# EAGLE schematic PCB_Sch_v4 (EAGLE 9.3.0)

## Sheet 1 of 2
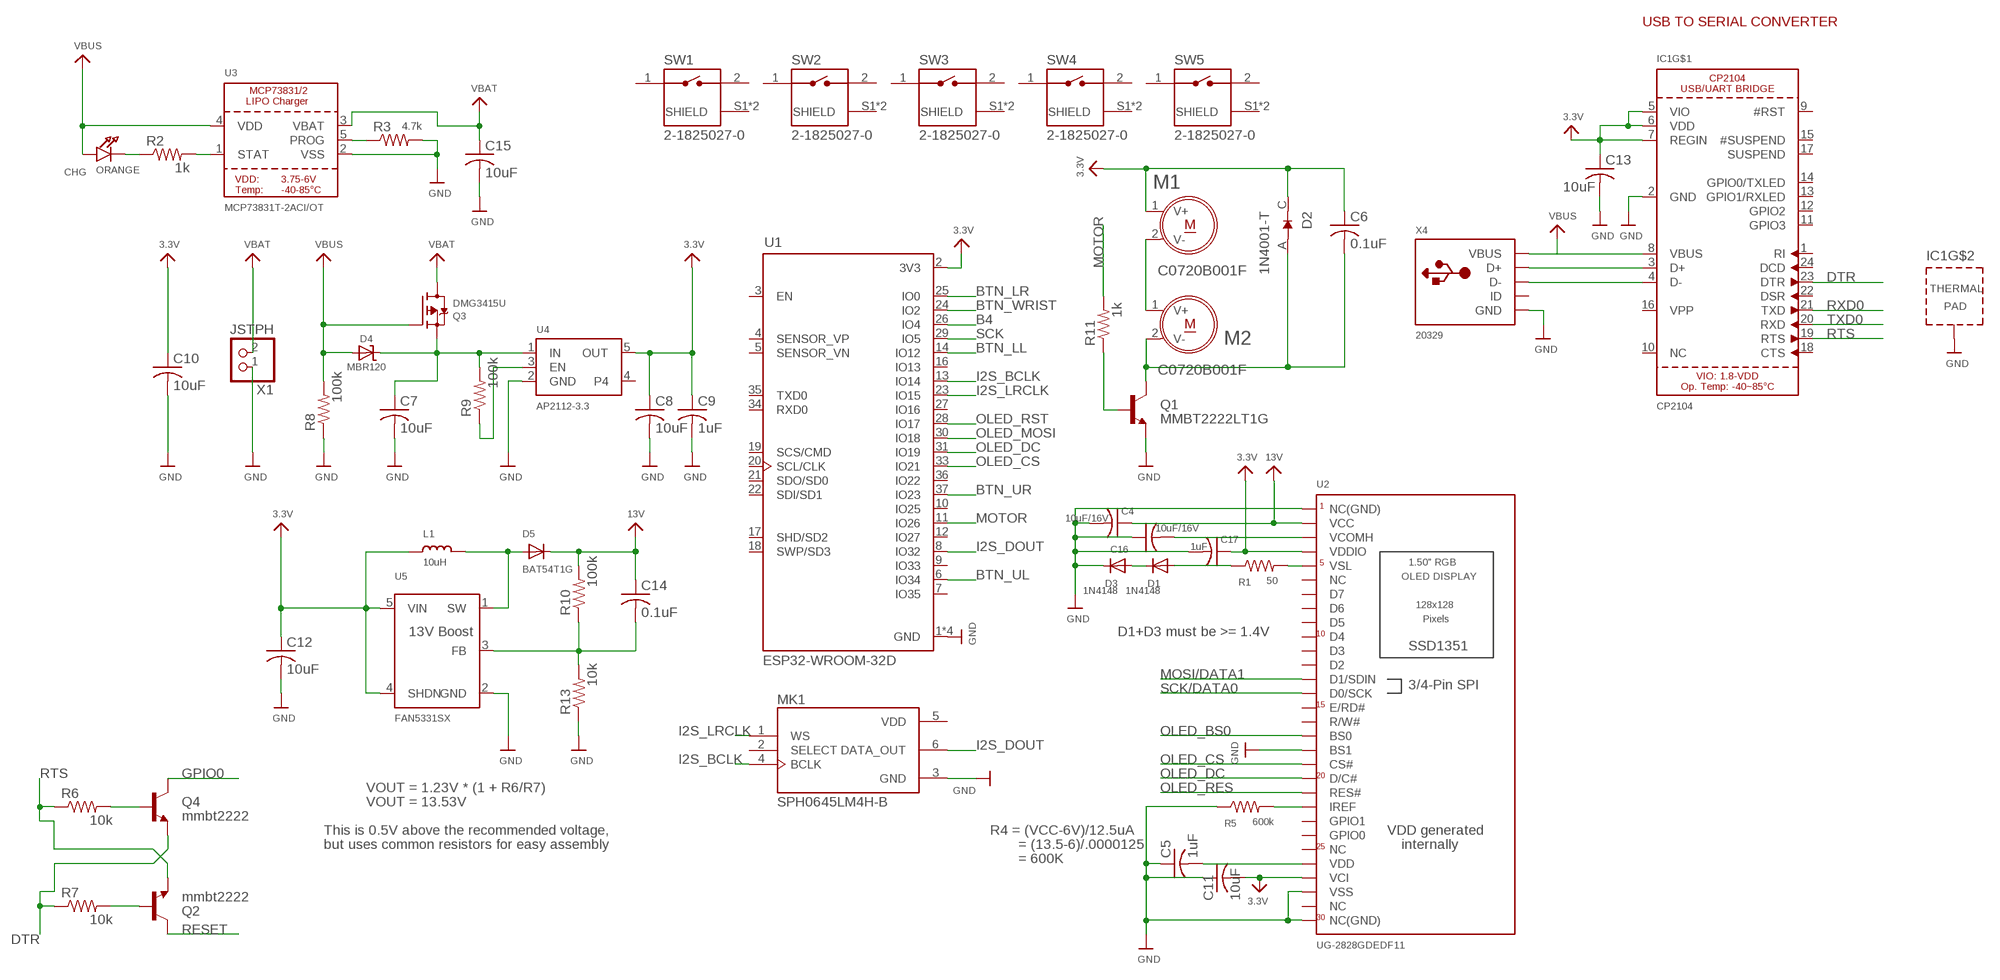
[diagram p0: schematic, sheet 1]

### Parts
C4  10uF/16V  C-USC0603  [C0603]
C5  1uF  C-USC0603  [C0603]
C6  0.1uF  C-USC0603  [C0603]
C7  10uF  C-USC0603  [C0603]
C8  10uF  C-USC0603  [C0603]
C9  1uF  C-USC0603  [C0603]
C10  10uF  C-USC0603  [C0603]
C11  10uF  C-USC0603  [C0603]
C12  10uF  C-USC0603  [C0603]
C13  10uF  C-USC0603  [C0603]
C14  0.1uF  C-USC0603  [C0603]
C15  10uF  C-USC0603  [C0603]
C16  10uF/16V  C-USC0603  [C0603]
C17  1uF  C-USC0603  [C0603]
CHG  ORANGE  LED0805_NOOUTLINE  [CHIPLED_0805_NOOUTLINE]
D1  1N4148  DIODESOD-323  [SOD-323]
D2  1N4001-T  [DIOAD953W69L521D272]
D3  1N4148  DIODESOD-323  [SOD-323]
D4  MBR120  DIODE-SCHOTTKYSOD-123  [SOD-123]
D5  BAT54T1G  DIODESOD-123  [SOD-123]
IC1  CP2104  [QFN24_4MM_SMSC]
L1  10uH  INDUCTOR  [INDUCTOR_1007]
M1  C0720B001F  [XDCR_C0720B001F]
M2  C0720B001F  [XDCR_C0720B001F]
MK1  SPH0645LM4H-B  [MIC_SPH0645LM4H-B]
Q1  MMBT2222LT1G  [SOT95P237X111-3N]
Q2  mmbt2222  TRANSISTOR_NPNSOT23-3  [SOT23-3]
Q3  DMG3415U  MOSFET-P  [SOT23-R]
Q4  mmbt2222  TRANSISTOR_NPNSOT23-3  [SOT23-3]
R1  50  R-US_R0603  [R0603]
R2  1k  R-US_R0603  [R0603]
R3  4.7k  R-US_R0603  [R0603]
R5  600k  R-US_R0603  [R0603]
R6  10k  R-US_R0603  [R0603]
R7  10k  R-US_R0603  [R0603]
R8  100k  R-US_R0603  [R0603]
R9  100k  R-US_R0603  [R0603]
R10  100k  R-US_R0603  [R0603]
R11  1k  R-US_R0603  [R0603]
R13  10k  R-US_R0603  [R0603]
SW1  2-1825027-0  [TE_2-1825027-0]
SW2  2-1825027-0  [TE_2-1825027-0]
SW3  2-1825027-0  [TE_2-1825027-0]
SW4  2-1825027-0  [TE_2-1825027-0]
SW5  2-1825027-0  [TE_2-1825027-0]
U1  ESP32-WROOM-32D  [MODULE_ESP32-WROOM-32D]
U2  UG-2828GDEDF11  DISP_OLED_UG-2828GDEDF11TOP  [FPC_XF2M-3015-1A]
U3  MCP73831T-2ACI/OT  MCP73831/2  [SOT23-5]
U4  AP2112-3.3  VREG_SOT23-5  [SOT23-5]
U5  FAN5331SX  FAN5331  [SOT23-5@1]
X1  JSTPH  CON_JST_PH_2PIN  [JSTPH2]
X4  20329  USB_MICRO_20329_V2  [4UCONN_20329_V2]

### Nets
3.3V: C6.1 C10.1 C11.2 C12.1 C13.1 C17.1 D2.C IC1.5(VIO) IC1.6(VDD) IC1.7(REGIN) L1.P$1 M1.1(V+) U1.2(3V3) U2.P$4(VCI) U2.P$27(VDDIO) U5.4(SHDN) U5.5(VIN)
13V: C4.1 C14.1 D5.C R10.2 U2.P$29(VCC)
B4: U1.26(IO4)
BTN_LL: U1.14(IO12)
BTN_LR: U1.25(IO0)
BTN_UL: U1.6(IO34)
BTN_UR: U1.37(IO23)
BTN_WRIST: U1.24(IO2)
DTR: IC1.23(DTR) Q4.2(E) R7.1
GND: C4.2 C5.1 C7.2 C8.2 C9.2 C10.2 C11.1 C12.2 C13.2 C15.2 C16.1 C17.2 D3.C IC1.2(GND) IC1.THERM(TP) MK1.3(GND) Q1.2(E) R3.2 R5.1 R8.1 R13.1 U1.1(GND) U1.15(GND) U1.38(GND) U1.39(GND) U2.P$1(NC(GND)) U2.P$3(VSS) U2.P$13(BS1) U2.P$30(NC(GND)) U3.2(VSS) U4.2(GND) U5.2(GND) X1.1 X4.BASE@1(GND) X4.BASE@2(GND) X4.GND X4.SPRT@1(GND) X4.SPRT@2(GND) X4.SPRT@3(GND) X4.SPRT@4(GND)
GPIO0: Q4.3(C)
I2S_BCLK: MK1.4(BCLK) U1.13(IO14)
I2S_DOUT: MK1.6(DATA_OUT) U1.8(IO32)
I2S_LRCLK: MK1.1(WS) U1.23(IO15)
MOSI/DATA1: U2.P$18(D1/SDIN)
MOTOR: R11.2 U1.11(IO26)
N$1: IC1.3(D+) X4.D+
N$2: Q1.1(B) R11.1
N$3: C5.2 U2.P$5(VDD)
N$4: C6.2 D2.A M2.2(V-) Q1.3(C)
N$5: IC1.4(D-) X4.D-
N$6: D1.A R1.1
N$7: R1.2 U2.P$26(VSL)
N$8: Q2.1(B) R7.2
N$9: Q4.1(B) R6.2
N$10: CHG.C R2.1
N$11: D1.C D3.A
N$12: C7.1 D4.C Q3.2(S) R9.2 U4.1(IN)
N$13: D5.A L1.P$2 U5.1(SW)
N$14: R9.1 U4.3(EN)
N$15: R2.2 U3.1(STAT)
N$16: C14.2 R10.1 R13.2 U5.3(FB)
N$17: R3.1 U3.5(PROG)
N$18: C16.2 U2.P$28(VCOMH)
N$19: R5.2 U2.P$9(IREF)
N$20: M1.2(V-) M2.1(V+)
OLED_BS0: U2.P$14(BS0)
OLED_CS: U1.33(IO21) U2.P$12(CS#)
OLED_DC: U1.31(IO19) U2.P$11(D/C#)
OLED_MOSI: U1.30(IO18)
OLED_RES: U2.P$10(RES#)
OLED_RST: U1.28(IO17)
OUT: C8.1 C9.1 U4.5(OUT) ; supply symbol labelled 3.3V
RESET: Q2.3(C)
RTS: IC1.19(RTS) Q2.2(E) R6.1
RXD0: IC1.21(TXD)
SCK: U1.29(IO5)
SCK/DATA0: U2.P$17(D0/SCK)
TXD0: IC1.20(RXD)
VBAT: C15.1 Q3.3(D) U3.3(VBAT) X1.2
VBUS: CHG.A D4.A Q3.1(G) R8.2 U3.4(VDD)
VBUS1: IC1.8(VBUS) X4.VBUS ; supply symbol labelled VBUS
Unconnected: IC1.1(RI) IC1.9(#RST) IC1.10(NC) IC1.11(GPIO3) IC1.12(GPIO2) IC1.13(GPIO1/RXLED) IC1.14(GPIO0/TXLED) IC1.15(#SUSPEND) IC1.16(VPP) IC1.17(SUSPEND) IC1.18(CTS) IC1.22(DSR) IC1.24(DCD) MK1.2(SELECT) SW1.1 SW1.2 SW1.S1(SHIELD) SW1.S2(SHIELD) SW2.1 SW2.2 SW2.S1(SHIELD) SW2.S2(SHIELD) SW3.1 SW3.2 SW3.S1(SHIELD) SW3.S2(SHIELD) SW4.1 SW4.2 SW4.S1(SHIELD) SW4.S2(SHIELD) SW5.1 SW5.2 SW5.S1(SHIELD) SW5.S2(SHIELD) U1.3(EN) U1.4(SENSOR_VP) U1.5(SENSOR_VN) U1.7(IO35) U1.9(IO33) U1.10(IO25) U1.12(IO27) U1.16(IO13) U1.17(SHD/SD2) U1.18(SWP/SD3) U1.19(SCS/CMD) U1.20(SCL/CLK) U1.21(SDO/SD0) U1.22(SDI/SD1) U1.27(IO16) U1.34(RXD0) U1.35(TXD0) U1.36(IO22) U2.P$2(NC) U2.P$6(NC) U2.P$7(GPIO0) U2.P$8(GPIO1) U2.P$15(R/W#) U2.P$16(E/RD#) U2.P$19(D2) U2.P$20(D3) U2.P$21(D4) U2.P$22(D5) U2.P$23(D6) U2.P$24(D7) U2.P$25(NC) U4.4 X4.ID

### Notes on the sheet
- USB TO SERIAL CONVERTER
- 13V Boost | D1+D3 must be >= 1.4V
- VOUT = 1.23V * (1 + R6/R7)
- VOUT = 13.53V
- This is 0.5V above the recommended voltage, | R4 = (VCC-6V)/12.5uA | VDD generated
- but uses common resistors for easy assembly | = (13.5-6)/.0000125 | internally
- = 600K

## Sheet 2 of 2

## Power pins joined to a net without a drawn wire
VDD: MK1.5(VDD)

## Library data of the parts
C4-C17 = rcl:C-US: CAPACITOR, American symbol; SPICEPREFIX: C
CHG = microbuilder:LED: LED 0603 - 0603 Surface Mount Package 2mA: Green LED - Low Power (3.9mcd, 2ma, 1.7Vf) - Digikey: 475-2709-2-ND Orange LED - Low Power (9.8mcd, 2ma, 1.8Vf) - Digikey: 475-1194-2-ND Red LED - Low Power (5mcd, 2ma, 1.8Vf) - Digikey: 475-1195-2-ND Yellow LED - Low Power (7mcd, 2ma, 1.8Vf) - Digikey: 475-1196-2-ND 5mA: Blue LED - Low Power (17mcd, 5ma, 2.9Vf) - Digikey: LNJ937W8CRACT-ND 0805 - 0805 Surface Mount Package 2mA: Red LED (8.8mcd, 2mA, 1.8Vf, Clear) - Low Power [Digikey: 475-2510-1-ND] Green LED (5mcd, 2mA, 1.8Vf, Clear) - Low Power [Digikey: 475-2730-1-ND] Yellow LED (11.3mcd, 2mA, 1.8Vf, Clear) - Low Power [Digikey: 475-2555-1-ND] 20mA: Red LED (104mcd, 20mA, Diffused) - LS R976 [Digikey: 475-1278-6-ND] Red LED (12mcd, 20mA, 2.0Vf, Clear) - APT2012EC [Digikey: 754-1128-1-ND] Green LED (15mcd, 20mA, 2.2Vf, Clear) - APT2012GC [Digikey: 754-1131-1-ND] Orange LED (160mcd, 20mA, 2.1Vf, Clear) - APT2012SECK [Digikey: 754-1130-1-ND] 1206 - 1206 Surface Mount Package Green LED (26mcd, 20mA, Diffused) - LG N971 [Digikey: 475-1407-6-ND] Red LED (15mcd, 20mA, Diffused) - LH N974 [Digikey: 475-1416-6-ND] Cree - Cree High-Power Surface Mount LEDs XPEBWT-L1-0000-00D50 - White 111lm 350mA 2.9Vf 6200K 110° XTEAWT-00-0000-00000LEE3 - White 114lm 350mA 2.85Vf 5000K 115° Everlight - Everlight 45-21 Series Surface Mount LEDs 45-21/QK2C-B2832AC2CB2/2T - Warm White 2000mcd 20mA 3.25Vf 3050K 120° 45-21/LK2C-B38452C4CB2/2T - Nuetral White 2000mcd 20mA 3.25Vf 4150K 120° 45-21/LK2C-B50634C6CB2/2T - Cold White 2200mcd 20mA 3.25Vf 5650K 120° PLCC2 Reverse Mount LS T77K-J1L2-1-0-2-R18-Z - Red 11.25mcd 2mA 1.8Vf 630nm 120° LO T77K-L1M2-24-Z - Orange 19.6mcd 2mA 1.8Vf 606nm 120° LY T77K-K2M1-26-Z - Yellow 15.7mcd 2mA 1.8Vf 587nm 120°
D1 D3 D5 = microbuilder:DIODE: Diode SMA Model Volts Amps Type Vf Vr Digikey # Notes SSA34-E3 40V 3A Schottky 480mV @ 3A 200uA @ 40V SSA34-E3/61TGITR-ND CDBA120-G 20V 1A Schottky 500mV @ 1A 500uA @ 20V 641-1014-6-ND REEL MBRA210 10V 2A Schottky 350mV @ 2A 700uA @ 10V MBRA210LT3 SOD-123 Model Volts Amps Type Vf Vr Order # Notes BAT54T1G 30V 200mA Schottky 800mV @ 200mA 2uA @ 25V BAT54T1GOSTR-ND B0530W 30V 500mA Schottky 430mV @ 500mA 130uA @ 30V B0530W-FDICT-ND REEL MBR120 20V 1A Schottky 340mV @ 1A MBR120VLSFT1GOSCT-ND SOD-323 Model Volts Amps Type Vf Vr Order # Notes PMEG2005EJ 20V 500mA Schottky 355mV @ 500mA 568-4110-1-ND ZLLS410 10V 570mA Schottky 380mV @ 570mA ZLLS410CT-ND 1N4148WS 75V 150mA Silicon/Simple 1V 1N4148WSFSCT-ND REEL SOD-523 Model Volts Amps Type Vf Vr Order # Notes BAT54XV2 30V 200mA Schottky 0.8V @ 100mA BAT54XV2CT-ND TB751S 30V 30mA Schottky RB751S-40TE61CT-ND SOT23-R/W (R = Solder Paste/Reflow Ovens, W = Hand-Soldering) Model Volts Amps Type Vf Vr Order # Notes BAT54FILM 40V 300mA Schottky 497-7162-1-ND
D2 = 1N4001-T:1N4001-T: Diode, Standard Recovery, 1a, 50v, Do-204al-2, Full Reel; AVAILABILITY: Unavailable; DESCRIPTION: Diode, Standard, 1A, 50V; MF: ON Semiconductor; MP: 1N4001; PACKAGE: DO-41 ON Semiconductor; PRICE: None
D4 = microbuilder:DIODE-SCHOTTKY
IC1 = microbuilder:CP2104: CP2104 - USB to UART Bridge VDD Output: 3.45V
L1 = microbuilder:INDUCTOR: Inductors 0603: 10nH Ceramic Inductor - microwire antenna/RF (Digikey: 712-1434-2-ND) 0805: 560nH Ceramic Inductor - RF (Digikey: 553-1047-1-ND) 270nH Ceramic Inductor - Q = 40@250MHz, +-5%, 1 Ohm DC Resistance (Digikey: 535-10506-2-ND) 1007 (2518 Metric) SMT: 10µH 10% 250mOhm 820mA 1007 Inductor (Digikey: 587-2189-1-ND) 22µH 10% 500mOhm 580mA 1007 Inductor (Digikey: 587-2190-1-ND) 47µH 10% 950mOhm 420mA 1007 Inductor (Digikey: 587-2191-1-ND) 47µH 5% 100mOhm 1A 1008 Inductor (Digikey: 732-1816-1-ND) 5.0x5.0mm (Taiyo Yuden NR5040 Series) 6.8µH 20% 2.3A 64mOhm Inductor (Digikey: 587-2374-2-ND) 5.0x5.0mm (TDK VLC5045 Series) 4.7µH 20% 3.3A 34mOhm Inductor (Digikey: 445-6526-1-ND) 6.8µH 20% 2.7A 46mOhm Inductor (Digikey: 445-6527-1-ND) 6.0x6.0mm (TDK VLC6045 Series) 4.7µH 20% 3.8A 27mOhm Inductor (Digikey: 445-6538-2-ND) 6.8µH 20% 3A 41mOhm Inductor (Digikey: 445-6540-1-ND) 6.2µH 30% 2.2A 45mOhm Inductor (Digikey: SRR5028-6R2YCT-ND) - Not TDK VLC6045 but footprint should match 6.0x6.0mm (TDK SLF6045 Series) 6.8uH 30% 2A 33mOhm Inductor (Digikey: 445-4572-1-ND, Mouser: 810-SLF645T6R8N2R0PF) 6.0x6.0mm (Sumida CDRH5D28 Series) 6.2uH 30% 1.8A 45mOhm Inductor (Digikey: 308-1542-1-ND) Taiyo Yuden NR3015T2R2M - 2.2uH 20% 1.5A (Digikey: 587-1648-2-ND, Mouser: 963-NR3015T2R2M) - Used with TI TPS62172 CoilCraft RFID Transponder Coil - MA5532-AE (For use with AS3935 Lightning Sensor)
M1 M2 = C0720B001F:C0720B001F: Vibration Motor Coin 3v Flex; AVAILABILITY: Unavailable; DESCRIPTION: Vibration Motor Coin 3v Flex; MF: Jinlong Machinery; MP: C0720B001F; PACKAGE: Jinlong Machinery &amp; Electronics; PRICE: None
MK1 = SPH0645LM4H-B:SPH0645LM4H-B: Mic Mems Digital I2s Omni -26db; AVAILABILITY: Unavailable; DESCRIPTION: Mic Mems Digital I2s Omni -26db; MF: Knowles; MP: SPH0645LM4H-B; PACKAGE: SIP-7 Bourns; PRICE: None
Q1 = MMBT2222LT1G:MMBT2222LT1G: Bipolar (BJT) Transistor NPN 30V 600mA 250MHz 300mW Surface Mount SOT-23-3 (TO-236)
Q2 Q4 = SparkFun:TRANSISTOR_NPN: Transistor NPN BJT configuration in SOT23 package. MMBT2222 is the common NPN we use. Double check BCE configuration again layout.
Q3 = microbuilder:MOSFET-P: P-Channel Mosfet LEGEND VDS: Voltage Drain-Source ID: Drain Current RDS(ON): Drain-Source On-State Resistance VGS(TH): Gate-Source Threshold Voltage CISS: Drain-Source Input Capacitance SOT-23 Name VDS ID RDS(ON) VGS(TH) CISS Order Number IRLML5103 30V 760mA 600 mOhm -- 75pF @ 25V Digikey: IRLML5103PBFCT-ND IRLML6401 12V 4.3A 50 mOhm 950mV @ 250µA 830pF @ 10V Digikey: IRLML6401PBFTR-ND NTR0202PL 20V 400mA 800 mOhm 2.3V @ 250uA 70pF @ 5V Digikey: NTR0202PLT1GOSTR-ND NTR4101PT1G 20V 1.8A 85 mOhm 1.2V @ 250uA 675pF @ 10V Digikey: NTR4101PT1GOSCT-ND DMP2004K 20V 600mA 900 mOhm 1V @ 250uA 175pF @ 16V Digikey: DMP2004KDICT-ND PMV65XP 20V 3.9A 76 mOhm 950mV @ 1mA 725pF @ 20V Digikey: 568-2358-2-ND TO-252 Name VDS ID RDS(ON) VGS(TH) CISS Order Number AOD417 30V 25A 34 mOhm 3V @ 250µA 920pF @ 15V Digikey: 785-1106-2-ND PowerPak Name VDS ID RDS(ON) VGS(TH) CISS Order Number AON7401 30V 12A 14 mOhm 3V @ 250µA 2600pF @ 15V Digikey: 785-1302-1-ND
R1-R3 R5-R11 R13 = rcl:R-US_: RESISTOR, American symbol; SPICEPREFIX: R
SW1-SW5 = 2-1825027-0:2-1825027-0: Switch Tactile OFF (ON) SPST Round Button PC Pins 0.05A 24VDC 1.57N Thru-Hole Loose Piece; COMMENT: 2-1825027-0; DESCRIPTION: Switch Tactile OFF _ON_ SPST Round Button PC Pins 0.05A 24VDC 1.57N Thru-Hole Loose Piece; DIGI-KEY_PART_NUMBER: 450-1661-ND; DIGI-KEY_PURCHASE_URL: https://www.digikey.com/product-detail/en/te-connectivity-alcoswitch-switches/2-1825027-0/450-1661-ND/1632547?utm_source=snapeda&utm_medium=aggregator&utm_campaign=symbol; EU_ROHS_COMPLIANCE: Compliant; MF: TE Connectivity; MP: 2-1825027-0; PACKAGE: None; TE_PURCHASE_URL: https://www.te.com/usa-en/product-2-1825027-0.html?te_bu=Cor&te_type=disp&te_campaign=seda_glo_cor-seda-global-disp-prtnr-fy19-seda-model-bom-cta_sma-317_1&elqCampaignId=32493
U1 = ESP32-WROOM-32D:ESP32-WROOM-32D: IC: SoC; GPIO, I2C, I2S, IR, SD, SDIO, SPI, UART; 2.7÷3.6VDC; 20dBm; AVAILABILITY: Unavailable; DESCRIPTION: IC: SoC; GPIO, I2C, I2S, IR, SD, SDIO, SPI, UART; 2.7÷3.6VDC; 20dBm; MF: Espressif Systems; MP: ESP32-WROOM-32D; PACKAGE: Module Espressif Systems; PRICE: None
U2 = microbuilder:DISP_OLED_UG-2828GDEDF11: 128x128 1.5" RGB OLED - UG-2828GDEDF11 30-Pin 0.5mm Pitch FPC Cable (Top+Bottom Contacts) - OMRON XF2M-3015-1A (Digikey: OR723TR-ND) This FPC connector has contacts on the top and bottom, but the appropriate pin needs to be selected depending on whether the OLED will be inserted right-side up (use the TOP pinout) or upside-down (use the BOTTOM pinout).
U3 = microbuilder:MCP73831/2: MCP73831/2 LIPO Charger VDD: 3.75 - 6V Temp -40 - 85°C Programmable Charge Rate: 15-500mA NOTE: STAT is a tri-state logic output on the MCP73831 and an open-drain output on the MCP73832. SOT23-5 with 4.2V output and tri-state logic on STAT = MCP73831T-2ACI/OT
U4 = microbuilder:VREG_SOT23-5: SOT23-5 Fixed Voltage Regulators Part Current Out V Out V In V Dropout θJA (°C/W) TJ (°C) Digikey Part No. ADP121 150mA 3.3V 3.4-5.5V 0.09V @ 150mA -- -- ADP121-AUJZ33R7CT-ND ADP121 150mA 3.0V 3.1-5.5V 0.09V @ 150mA -- -- ADP121-AUJZ30R7CT-ND ADP122 300mA 3.3V 3.4-5.5V 0.085V @ 300mA -- -- ADP122AUJZ-3.3-R7CT-ND ADP1712 300mA 3.3V 3.5-5.5V 0.17V @ 300mA -- -- ADP1712AUJZ-3.3-R7TR-ND AP7311 (Low Cost) 150mA 3.3V 3.5-6V 0.15V @ 150mA -- -- AP7311-33WG-7DICT-ND LD39015M18R 150mA 1.8V 1.9V-5.5V 0.08V @ 100mA -- -- 497-6977-1-ND LP2985A-33DBVR 150mA 3.3V 3.3-16V 0.28V @ 150mA 206 150 296-18479-1-ND MCP1824T-3302E/OT 300mA 3.3V 3.5V-6V 0.2V @ 300mA -- -- MCP1824T-3302E/OTCT-ND MIC5205-2.5YM5 TR 150mA 2.5V 2.7-16V 0.165V @ 150mA -- -- 576-1257-2-ND MIC5205-3.0YM5 TR 150mA 3.0V 3.2V-16V 0.165V @ 150mA -- -- 576-1258-2-ND MIC5205-3.3YM5 TR 150mA 3.3V 3.5V-16V 0.165V @ 150mA -- -- 576-1259-2-ND TPS780330220 150mA 3.3V+2.2V 3.6-5.5V 250mV Max -- -- 296-23332-1-ND TDA3663/N1,135 100mA 3.3V 3.5-45V 0.18V @ 50mA -- -- 568-5343-1-ND Max operating temp can be calculated using θJA, TJ (max junction temperature), and power in watts. Set the "Maximum Ambient Temperature" until it reaches TJ ("Max Junction Temperature"), which is the absolute limit for safe use of the regulator: Heat Sink Temperature Calculator <http://www.daycounter.com/Calculators/Heat-Sink-Temperature-Calculator.phtml> For example, With 12V source into a 3.3V LP2985 and a 30mA load, we are dissipating (12V-3.3V) * 0.03A = 0.261W. With a θJA of 206 °C/W, a TJ of 150°C, and 261mW we can safely use the chip without a heat sink up to 75°C (=147.1°C Junction Temperature).
U5 = microbuilder:FAN5331: FAN5331 - LED/OLED 20V Boost Converter Digikey: FAN5331SXCT-ND
X1 = microbuilder:CON_JST_PH_2PIN: JST 2-Pin Right-Angle Connector PH-Series - 4UConnector: 17311 SH-Series - 4UConnector: 07278
X4 = microbuilder:USB: USB Connectors USBMINIB - Surface Mount Female Mini-B USB Connector 4UConnector: 06564